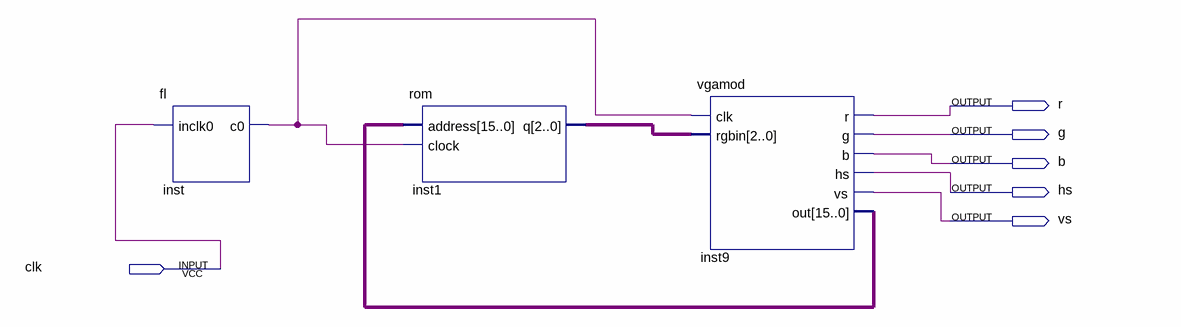
[diagram p0: schematic sheet]
// Quartus schematic vgaaaa.bdf as structural Verilog: 3 symbols, 6 pins
module vgaaaa (
  input  clk,
  output r,
  output g,
  output b,
  output hs,
  output vs
);

  wire inst_c0;
  wire [2:0] inst1_q;
  wire [15:0] inst9_out;

  fl inst (.inclk0(clk), .c0(inst_c0));
  rom inst1 (.address(inst9_out), .clock(inst_c0), .q(inst1_q));
  vgamod inst9 (.clk(inst_c0), .rgbin(inst1_q), .r(r), .g(g), .b(b), .hs(hs), .vs(vs), .out(inst9_out));
endmodule
